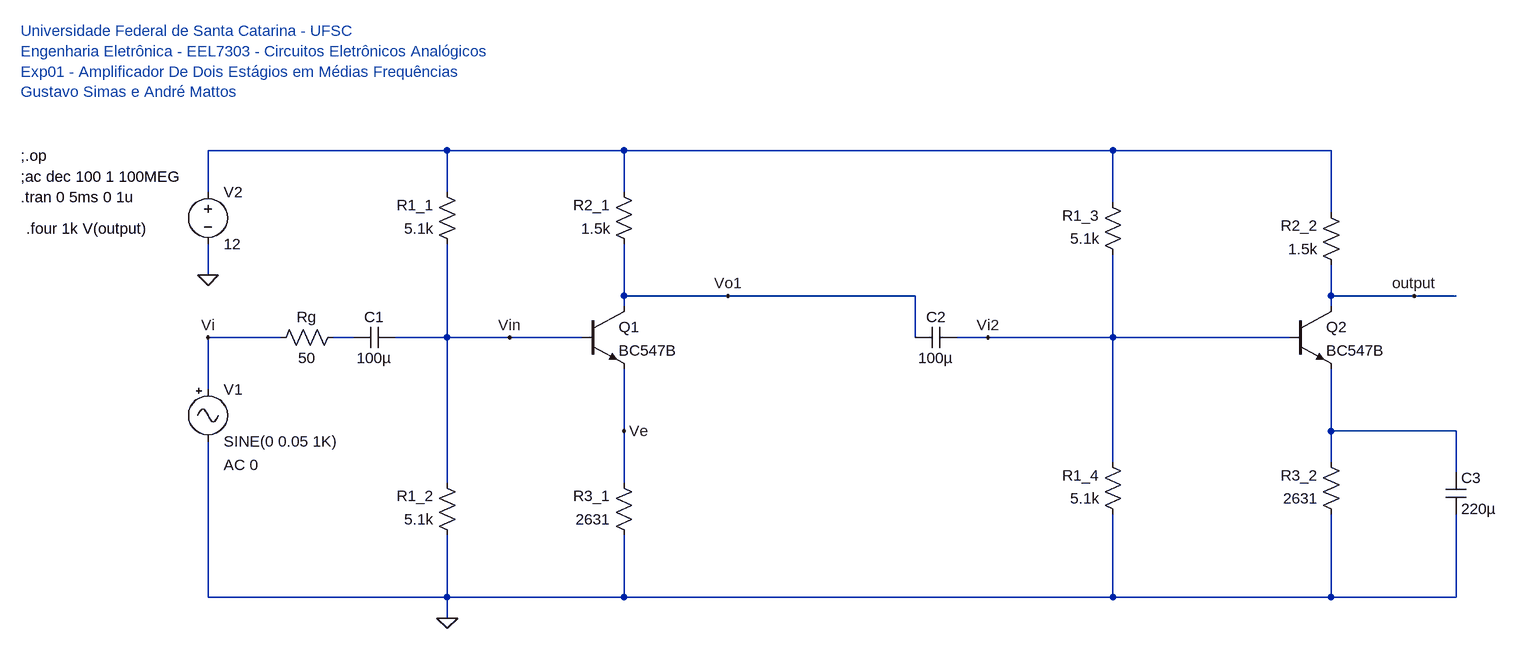
[diagram p0: schematic Lab01.asc]
Lab01.asc, the LTspice schematic file:
Version 4
SHEET 1 1768 680
WIRE 144 -352 -224 -352
WIRE 416 -352 144 -352
WIRE 1168 -352 416 -352
WIRE 1504 -352 1168 -352
WIRE -224 -288 -224 -352
WIRE 144 -288 144 -352
WIRE 416 -288 416 -352
WIRE 1168 -272 1168 -352
WIRE 1504 -256 1504 -352
WIRE -224 -160 -224 -208
WIRE 416 -128 416 -208
WIRE 576 -128 416 -128
WIRE 864 -128 576 -128
WIRE 1504 -128 1504 -176
WIRE 1632 -128 1504 -128
WIRE 1696 -128 1632 -128
WIRE 416 -112 416 -128
WIRE 1504 -112 1504 -128
WIRE -112 -64 -224 -64
WIRE 0 -64 -32 -64
WIRE 144 -64 144 -208
WIRE 144 -64 64 -64
WIRE 240 -64 144 -64
WIRE 352 -64 240 -64
WIRE 864 -64 864 -128
WIRE 976 -64 928 -64
WIRE 1168 -64 1168 -192
WIRE 1168 -64 976 -64
WIRE 1440 -64 1168 -64
WIRE -224 16 -224 -64
WIRE 416 80 416 -16
WIRE 1504 80 1504 -16
WIRE 1696 80 1504 80
WIRE 1168 128 1168 -64
WIRE 1504 128 1504 80
WIRE 1696 144 1696 80
WIRE 144 160 144 -64
WIRE 416 160 416 80
WIRE -224 336 -224 96
WIRE 144 336 144 240
WIRE 144 336 -224 336
WIRE 416 336 416 240
WIRE 416 336 144 336
WIRE 1168 336 1168 208
WIRE 1168 336 416 336
WIRE 1504 336 1504 208
WIRE 1504 336 1168 336
WIRE 1696 336 1696 208
WIRE 1696 336 1504 336
WIRE 144 368 144 336
FLAG -224 -160 0
FLAG 144 368 0
FLAG -224 -64 Vi
FLAG 240 -64 Vin
FLAG 576 -128 Vo1
FLAG 1632 -128 output
FLAG 416 80 Ve
FLAG 976 -64 Vi2
SYMBOL Misc\\signal -224 0 R0
WINDOW 123 24 132 Left 2
WINDOW 39 0 0 Left 0
SYMATTR Value2 AC 0
SYMATTR InstName V1
SYMATTR Value SINE(0 0.05 1K)
SYMBOL res -16 -80 R90
WINDOW 0 0 56 VBottom 2
WINDOW 3 32 56 VTop 2
SYMATTR InstName Rg
SYMATTR Value 50
SYMBOL res 160 -192 R180
WINDOW 0 36 76 Left 2
WINDOW 3 36 40 Left 2
SYMATTR InstName R1_1
SYMATTR Value 5.1k
SYMBOL res 160 256 R180
WINDOW 0 36 76 Left 2
WINDOW 3 36 40 Left 2
SYMATTR InstName R1_2
SYMATTR Value 5.1k
SYMBOL res 432 -192 R180
WINDOW 0 36 76 Left 2
WINDOW 3 36 40 Left 2
SYMATTR InstName R2_1
SYMATTR Value 1.5k
SYMBOL res 432 256 R180
WINDOW 0 36 76 Left 2
WINDOW 3 36 40 Left 2
SYMATTR InstName R3_1
SYMATTR Value 2631
SYMBOL npn 352 -112 R0
SYMATTR InstName Q1
SYMATTR Value BC547B
SYMBOL voltage -224 -304 R0
SYMATTR InstName V2
SYMATTR Value 12
SYMBOL cap 64 -80 R90
WINDOW 0 0 32 VBottom 2
WINDOW 3 32 32 VTop 2
SYMATTR InstName C1
SYMATTR Value 100µ
SYMBOL cap 928 -80 R90
WINDOW 0 0 32 VBottom 2
WINDOW 3 32 32 VTop 2
SYMATTR InstName C2
SYMATTR Value 100µ
SYMBOL npn 1440 -112 R0
SYMATTR InstName Q2
SYMATTR Value BC547B
SYMBOL res 1184 -176 R180
WINDOW 0 36 76 Left 2
WINDOW 3 36 40 Left 2
SYMATTR InstName R1_3
SYMATTR Value 5.1k
SYMBOL res 1520 -160 R180
WINDOW 0 36 76 Left 2
WINDOW 3 36 40 Left 2
SYMATTR InstName R2_2
SYMATTR Value 1.5k
SYMBOL res 1184 224 R180
WINDOW 0 36 76 Left 2
WINDOW 3 36 40 Left 2
SYMATTR InstName R1_4
SYMATTR Value 5.1k
SYMBOL res 1520 224 R180
WINDOW 0 36 76 Left 2
WINDOW 3 36 40 Left 2
SYMATTR InstName R3_2
SYMATTR Value 2631
SYMBOL cap 1680 144 R0
SYMATTR InstName C3
SYMATTR Value 220µ
TEXT -512 -344 Left 2 !;.op
TEXT -512 -312 Left 2 !;ac dec 100 1 100MEG
TEXT -512 -280 Left 2 !.tran 0 5ms 0 1u
TEXT -512 -536 Left 2 ;Universidade Federal de Santa Catarina - UFSC\nEngenharia Eletrônica - EEL7303 - Circuitos Eletrônicos Analógicos\nExp01 - Amplificador De Dois Estágios em Médias Frequências\nGustavo Simas e André Mattos
TEXT -504 -232 Left 2 !.four 1k V(output)

The netlist it stands for:
* Lab01.asc
V1 Vi 0 SINE(0 0.05 1K) AC 0
Rg N002 Vi 50
R1_1 Vin N001 5.1k
R1_2 0 Vin 5.1k
R2_1 Vo1 N001 1.5k
R3_1 0 Ve 2631
Q1 Vo1 Vin Ve 0 BC547B
V2 N001 0 12
C1 Vin N002 100µ
C2 Vi2 Vo1 100µ
Q2 output Vi2 N003 0 BC547B
R1_3 Vi2 N001 5.1k
R2_2 output N001 1.5k
R1_4 0 Vi2 5.1k
R3_2 0 N003 2631
C3 N003 0 220µ
.model NPN NPN
.model PNP PNP
.lib standard.bjt
;.op
;ac dec 100 1 100MEG
.tran 0 5ms 0 1u
* Universidade Federal de Santa Catarina - UFSC
* Engenharia Eletrônica - EEL7303 - Circuitos Eletrônicos Analógicos
* Exp01 - Amplificador De Dois Estágios em Médias Frequências
* Gustavo Simas e André Mattos
.four 1k V(output)
.backanno
.end